# Altium schematic sheet 06 Memories.SchDoc
size A
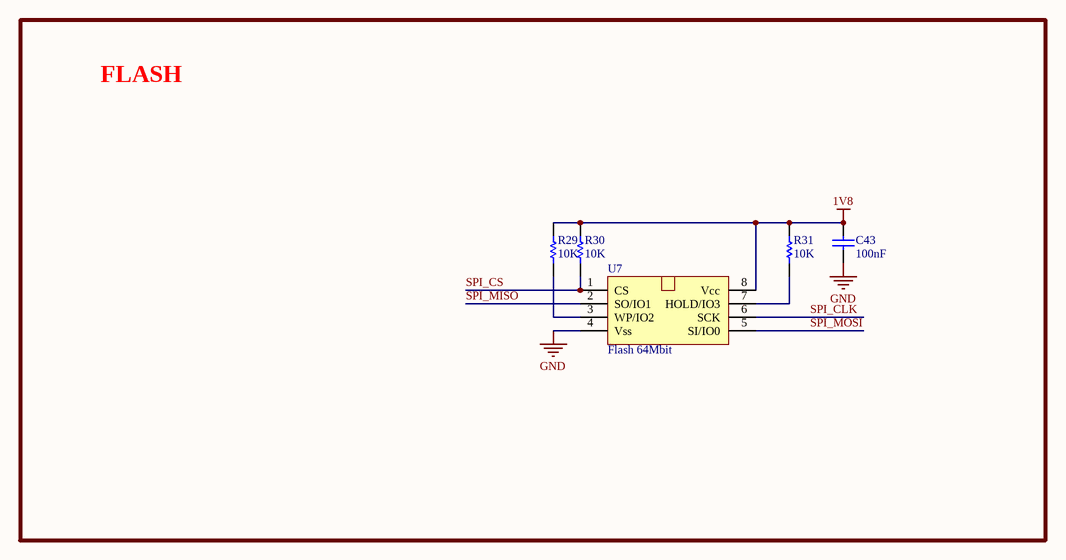
[diagram p0: 06 Memories.SchDoc]

## Parts
C43  100nF  [0603 - C]
R29  10K  [0603 - R]
R30  10K  [0603 - R]
R31  10K  [0603 - R]
U7  Flash 64Mbit  [8 - SOIC]

## Blocks framed on the sheet
FLASH: C43 R29-R31 U7

## Nets
1V8: C43.2 R29.2 R30.2 R31.2 U7.8(Vcc)
GND: C43.1 U7.4(Vss)
SPI_CLK: U7.6(SCK)
SPI_CS: R30.1 U7.1(CS)
SPI_MISO: U7.2(SO/IO1)
SPI_MOSI: U7.5(SI/IO0)
NetR29_1: R29.1 U7.3(WP/IO2)
NetR31_1: R31.1 U7.7(HOLD/IO3)

## Library data of the parts
C43 = Cap 0603 100nF: CAP CER 100nF 50V C0G/NP0 0603; MPN: CL10C104JB8NNNC; MFR: SAMSUNG; Company ID: VT_TỤ ĐIỆN_C0603 100nF; Voltage: 50V; Package: 0603; Value: 100nF; Size: C0603: 100nF
R29-R31 = Res 0603 10K: RES SMD 10K OHM 1% 1/10W 0603; MFR: Yageo; MPN: RC0603FR-0710KL; Company ID: VT_ĐIỆN TRỞ_R0603 10K; Value: 10K; Size: R0603: 10K
U7 = Flash 64Mb-1.8V: IC FLASH 64MBIT CMOS SPI 8SOIC 1.8V; MFR: Gigadevice; MPN: GD25LQ64ESIGR; ComponentLink1Description: New link; ComponentLink1URL: *; MPN 2: W25Q64JWSSIQ; MFR 2: Winbond; MPN 3: EN25S64-104RIP; MFR 3: Cfeon; MPN 4: P25Q64LE-SUH-IR; MFR 4: Puyasemi